# EAGLE schematic TestJig (EAGLE 6.5.0)
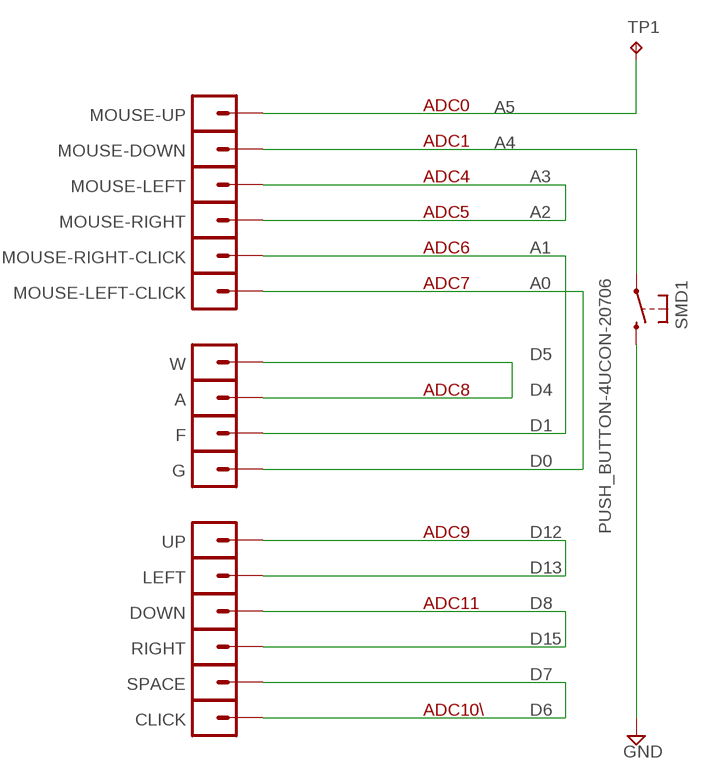
[diagram p0: schematic, sheet 1]

## Parts
A  MA01-1-ALLIGATOR-3.0MM  [MA01-1-ALLIGATOR-3.0MM]
CLICK  MA01-1-ALLIGATOR-3.0MM  [MA01-1-ALLIGATOR-3.0MM]
DOWN  MA01-1-ALLIGATOR-3.0MM  [MA01-1-ALLIGATOR-3.0MM]
F  MA01-1-ALLIGATOR-3.0MM  [MA01-1-ALLIGATOR-3.0MM]
G  MA01-1-ALLIGATOR-3.0MM  [MA01-1-ALLIGATOR-3.0MM]
LEFT  MA01-1-ALLIGATOR-3.0MM  [MA01-1-ALLIGATOR-3.0MM]
MOUSE-DOWN  MA01-1-ALLIGATOR-3.0MM  [MA01-1-ALLIGATOR-3.0MM]
MOUSE-LEFT  MA01-1-ALLIGATOR-3.0MM  [MA01-1-ALLIGATOR-3.0MM]
MOUSE-LEFT-CLICK  MA01-1-ALLIGATOR-3.0MM  [MA01-1-ALLIGATOR-3.0MM]
MOUSE-RIGHT  MA01-1-ALLIGATOR-3.0MM  [MA01-1-ALLIGATOR-3.0MM]
MOUSE-RIGHT-CLICK  MA01-1-ALLIGATOR-3.0MM  [MA01-1-ALLIGATOR-3.0MM]
MOUSE-UP  MA01-1-ALLIGATOR-3.0MM  [MA01-1-ALLIGATOR-3.0MM]
RIGHT  MA01-1-ALLIGATOR-3.0MM  [MA01-1-ALLIGATOR-3.0MM]
SMD1  PUSH_BUTTON-4UCON-20706  [PUSH_BUTTON-4UCON-20706]
SPACE  MA01-1-ALLIGATOR-3.0MM  [MA01-1-ALLIGATOR-3.0MM]
TP1  TESTPAD-2.54MM  [TP-2.54MM]
UP  MA01-1-ALLIGATOR-3.0MM  [MA01-1-ALLIGATOR-3.0MM]
W  MA01-1-ALLIGATOR-3.0MM  [MA01-1-ALLIGATOR-3.0MM]

## Nets
A0: G.1@0 G.1@1 MOUSE-LEFT-CLICK.1@0 MOUSE-LEFT-CLICK.1@1
A1: F.1@0 F.1@1 MOUSE-RIGHT-CLICK.1@0 MOUSE-RIGHT-CLICK.1@1
A3: MOUSE-LEFT.1@0 MOUSE-LEFT.1@1 MOUSE-RIGHT.1@0 MOUSE-RIGHT.1@1
A4: MOUSE-DOWN.1@0 MOUSE-DOWN.1@1 SMD1.1 SMD1.2
A5: MOUSE-UP.1@0 MOUSE-UP.1@1 TP1.TP
D5: A.1@0 A.1@1 W.1@0 W.1@1
D7: CLICK.1@0 CLICK.1@1 SPACE.1@0 SPACE.1@1
D8: DOWN.1@0 DOWN.1@1 RIGHT.1@0 RIGHT.1@1
D12: LEFT.1@0 LEFT.1@1 UP.1@0 UP.1@1
GND: SMD1.3 SMD1.4

## Notes on the sheet
- ADC0
- ADC1
- ADC4 | A3
- ADC5 | A2
- ADC6 | A1
- ADC7 | A0
- D5
- ADC8 | D4
- D1
- D0
- ADC9 | D12
- D13
- ADC11 | D8
- D15
- D7
- ADC10\ | D6

## Library data of the parts
A CLICK DOWN F G LEFT MOUSE-DOWN MOUSE-LEFT MOUSE-LEFT-CLICK MOUSE-RIGHT MOUSE-RIGHT-CLICK MOUSE-UP RIGHT SPACE UP W = SixthLogic:MA01-1-ALLIGATOR: 2x Holes for Alligator Clips; DESCRIPTION: 2x3mm Holes for Alligator Clips
SMD1 = SixthLogic:PUSH_BUTTON: PUSH BUTTON; DESCRIPTION: 4P SMT 180° GROUND PIN IN CENTRAL H=1.5m; MF: 4UCON; MPN: 20706; URL: http://www.4uconnector.com/online/Itemadrawing.asp?fldseries=20706&seriesno_a=32
TP1 = SixthLogic:TESTPAD